# Altium schematic sheet SLOW.SchDoc
size A3; CompanyName: HESSO; Address1: Route du Rawyl 47; Address2: 1950 Sion; Address3: Switzerland; SheetNumber: 3; SheetTotal: 4; PageSetup: Record=PageOptions|CenterHorizontal=True|CenterVertical=True|PrintScale=1.00|XCorrection=1.00|YCorrection=1.00|PrintKind=1|BorderSize=5000000|LeftOffset=0|BottomOffset=0|Orientation=2|PaperLength=1000|PaperWidth=1000|Scale=100|PaperSource=15|PrintQuality=1200|MediaType=1|DitherType=10|PrintScaleMode=1|PaperKind=A4|PaperIndex=9; ProjectName: Project Name
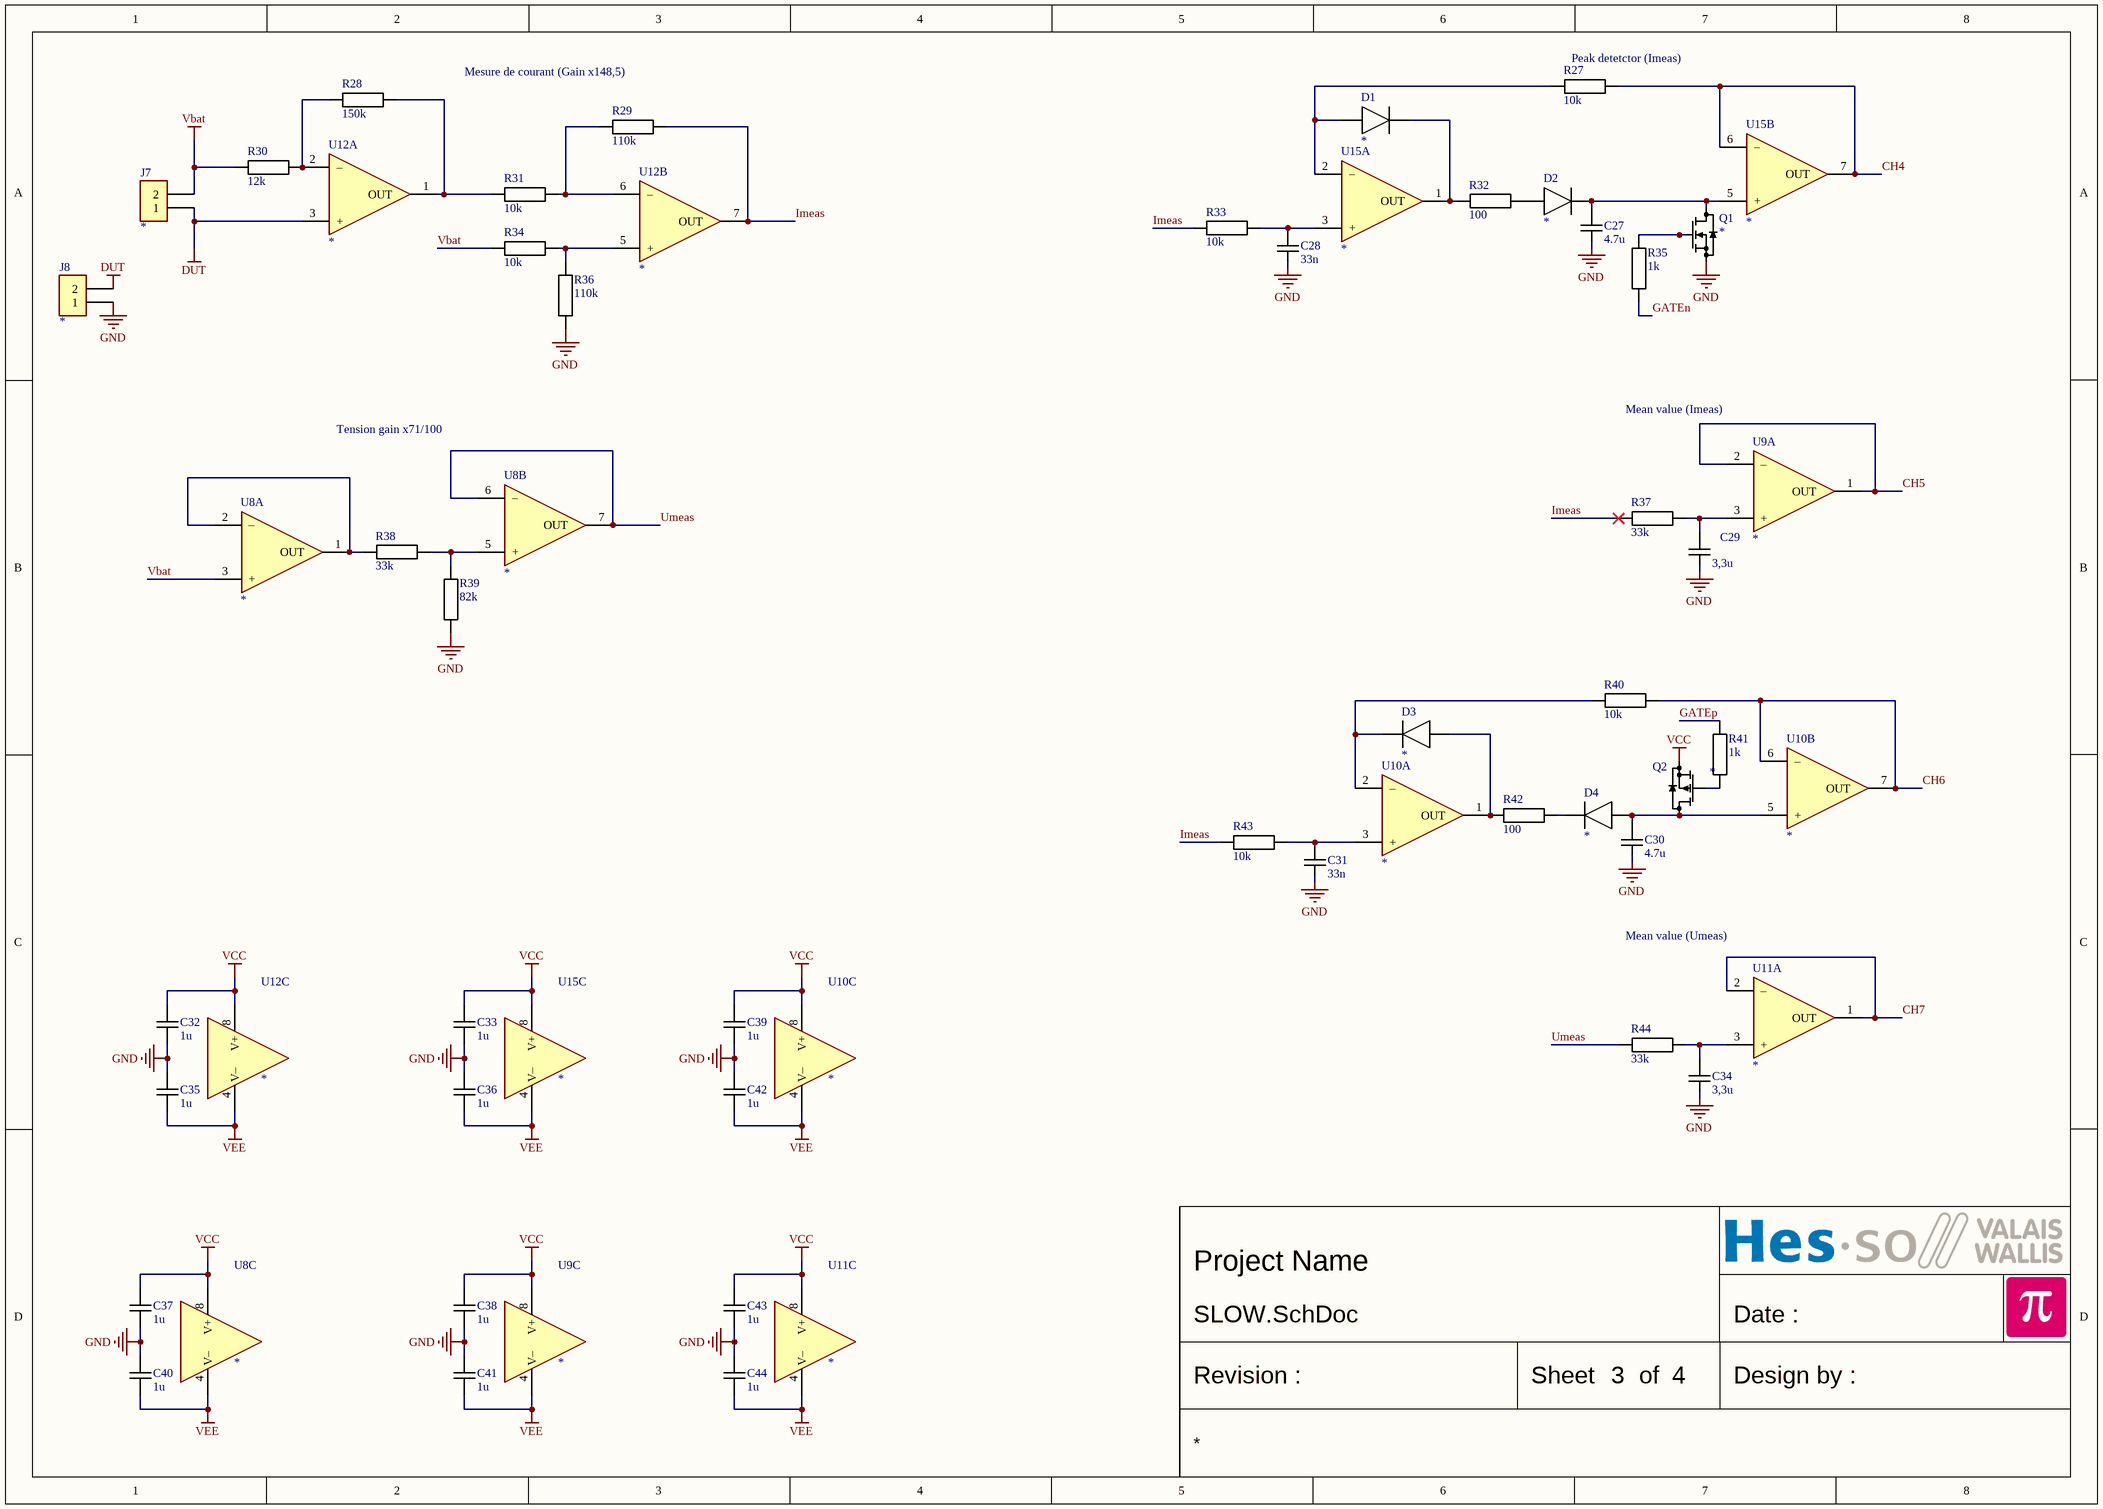
[diagram p0: SLOW.SchDoc]

## Parts
C27  4.7u  [CAPACITOR 1005 REFLOW]
C28  33n  [CAPACITOR 1005 REFLOW]
C29  3,3u  [CAPACITOR 1005 REFLOW]
C30  4.7u  [CAPACITOR 1005 REFLOW]
C31  33n  [CAPACITOR 1005 REFLOW]
C32  1u  [CAPACITOR 1005 REFLOW]
C33  1u  [CAPACITOR 1005 REFLOW]
C34  3,3u  [CAPACITOR 1005 REFLOW]
C35  1u  [CAPACITOR 1005 REFLOW]
C36  1u  [CAPACITOR 1005 REFLOW]
C37  1u  [CAPACITOR 1005 REFLOW]
C38  1u  [CAPACITOR 1005 REFLOW]
C39  1u  [CAPACITOR 1005 REFLOW]
C40  1u  [CAPACITOR 1005 REFLOW]
C41  1u  [CAPACITOR 1005 REFLOW]
C42  1u  [CAPACITOR 1005 REFLOW]
C43  1u  [CAPACITOR 1005 REFLOW]
C44  1u  [CAPACITOR 1005 REFLOW]
D1  *  [DIODE SOD323 REFLOW]
D2  *  [DIODE SOD323 REFLOW]
D3  *  [DIODE SOD323 REFLOW]
D4  *  [DIODE SOD323 REFLOW]
J7  *  [WE 691312510002]
J8  *  [WE 691312510002]
Q1  *  [SOT23 P0.95 C1.6x3.0 H1.3]
Q2  *  [SOT23 P0.95 C1.6x3.0 H1.3]
R27  10k  [RESISTOR 1005 REFLOW]
R28  150k  [RESISTOR 1005 REFLOW]
R29  110k  [RESISTOR 1005 REFLOW]
R30  12k  [RESISTOR 1005 REFLOW]
R31  10k  [RESISTOR 1005 REFLOW]
R32  100  [RESISTOR 1005 REFLOW]
R33  10k  [RESISTOR 1005 REFLOW]
R34  10k  [RESISTOR 1005 REFLOW]
R35  1k  [RESISTOR 1005 REFLOW]
R36  110k  [RESISTOR 1005 REFLOW]
R37  33k  [RESISTOR 1005 REFLOW]
R38  33k  [RESISTOR 1005 REFLOW]
R39  82k  [RESISTOR 1005 REFLOW]
R40  10k  [RESISTOR 1005 REFLOW]
R41  1k  [RESISTOR 1005 REFLOW]
R42  100  [RESISTOR 1005 REFLOW]
R43  10k  [RESISTOR 1005 REFLOW]
R44  33k  [RESISTOR 1005 REFLOW]
U8  *  [SO8 P1.27 C4.0X5.0 H1.75]  (parts A,B,C of 3)
U9  *  [SO8 P1.27 C4.0X5.0 H1.75]  (parts A,C of 3)
U10  *  [SO8 P1.27 C4.0X5.0 H1.75]  (parts A,B,C of 3)
U11  *  [SO8 P1.27 C4.0X5.0 H1.75]  (parts A,C of 3)
U12  *  [SO8 P1.27 C4.0X5.0 H1.75]  (parts A,B,C of 3)
U15  *  [SO8 P1.27 C4.0X5.0 H1.75]  (parts A,B,C of 3)

## Nets
DUT: J7.1 J8.2 U12.3(+)
GND: C27.2 C28.2 C29.2 C30.2 C31.2 C32.2 C33.2 C34.2 C35.1 C36.1 C37.2 C38.2 C39.2 C40.1 C41.1 C42.1 C43.2 C44.1 J8.1 Q1.2(S) R36.1 R39.1
Vbat: J7.2 R30.1 R34.1 U8.3(+)
VCC: C32.1 C33.1 C37.1 C38.1 C39.1 C43.1 Q2.2(S) U8.8(V+) U9.8(V+) U10.8(V+) U11.8(V+) U12.8(V+) U15.8(V+)
VEE: C35.2 C36.2 C40.2 C41.2 C42.2 C44.2 U8.4(V–) U9.4(V–) U10.4(V–) U11.4(V–) U12.4(V–) U15.4(V–)
CH4: R27.1 U15.6(–) U15.7(OUT)
CH5: U9.1(OUT) U9.2(–)
CH6: R40.1 U10.6(–) U10.7(OUT)
CH7: U11.1(OUT) U11.2(–)
GATEn: R35.2
GATEp: R41.1
Imeas: R29.2 R33.2 R37.2 R43.2 U12.7(OUT)
Umeas: R44.2 U8.6(–) U8.7(OUT)
NetC27_1: C27.1 D2.1(C) Q1.3(D) U15.5(+)
NetC28_1: C28.1 R33.1 U15.3(+)
NetC29_1: C29.1 R37.1 U9.3(+)
NetC30_1: C30.1 D4.2(A) Q2.3(D) U10.5(+)
NetC31_1: C31.1 R43.1 U10.3(+)
NetC34_1: C34.1 R44.1 U11.3(+)
NetD1_1: D1.1(C) R32.2 U15.1(OUT)
NetD1_2: D1.2(A) R27.2 U15.2(–)
NetD2_2: D2.2(A) R32.1
NetD3_1: D3.1(C) R40.2 U10.2(–)
NetD3_2: D3.2(A) R42.2 U10.1(OUT)
NetD4_1: D4.1(C) R42.1
NetQ1_1: Q1.1(G) R35.1
NetQ2_1: Q2.1(G) R41.2
NetR28_1: R28.1 R30.2 U12.2(–)
NetR28_2: R28.2 R31.1 U12.1(OUT)
NetR29_1: R29.1 R31.2 U12.6(–)
NetR34_2: R34.2 R36.2 U12.5(+)
NetR38_1: R38.1 U8.1(OUT) U8.2(–)
NetR38_2: R38.2 R39.2 U8.5(+)

## Notes on the sheet
- (near R29) Mesure de courant (Gain x148,5)
- (near R27) Peak detetctor (Imeas)
- Tension gain x71/100
- (near U9) Mean value (Imeas)
- (near U11) Mean value (Umeas)
- Date :
- Revision :
- Sheet
- of
- Design by :

## Library data of the parts
C27-C44 = Capacitor
  C27 C30: Value: 4.7u
  C28 C31: Value: 33n
  C29 C34: Value: 3,3u
  C32 C33 C35-C44: Value: 1u
D1-D4 = DIODE: Diode generic 2 leads; Value: *
J7 J8 = Header2: PCB terminal block; Value: *
Q1 = MOS-N SOT23 S-D-G: Generic MOS-N; pin to pad: 1>3 2>1 3>2; Value: *
Q2 = MOS-P SOT23 G-S-D: Generic MOS-P; Value: *
R27-R44 = Resistor
  R27 R31 R33 R34 R40 R43: Value: 10k
  R28: Value: 150k
  R29 R36: Value: 110k
  R30: Value: 12k
  R32 R42: Value: 100
  R35 R41: Value: 1k
  R37 R38 R44: Value: 33k
  R39: Value: 82k
U8-U12 U15 = OPA DUAL: Generic dual OPA 8 pins; Value: *